# EAGLE design rec_2dek (EAGLE 6.1)
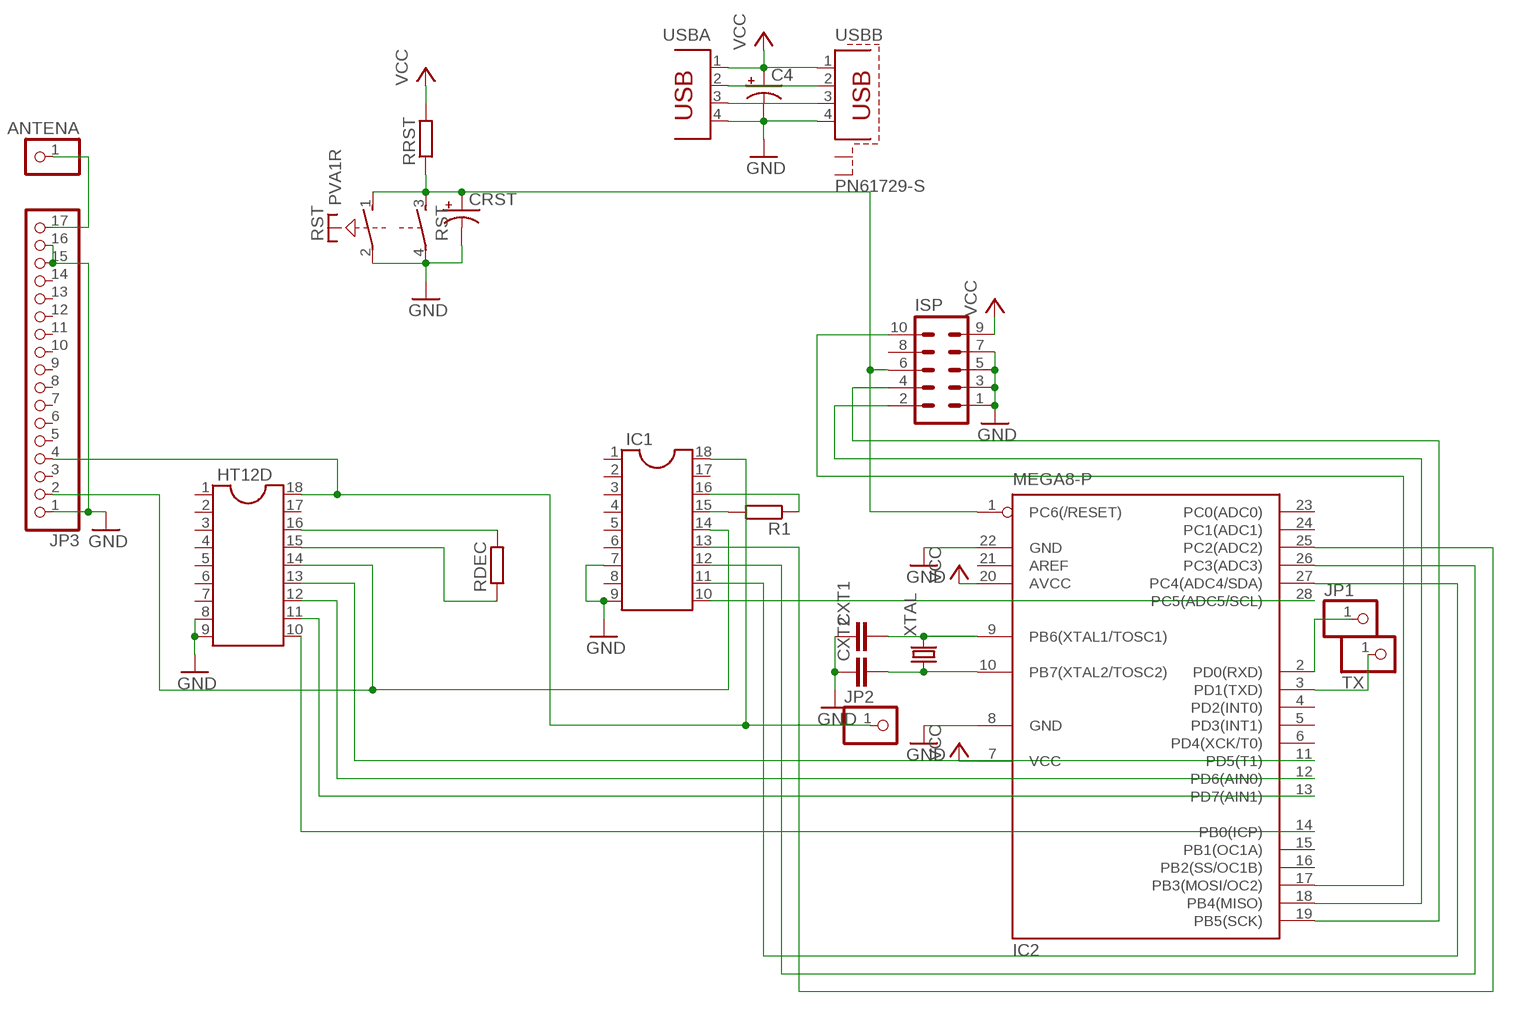
[diagram p0: schematic, sheet 1]

## Parts
ANTENA  PINHD-1X1  [1X01]
C4  CPOL-USE2.5-7  [E2,5-7]
CRST  CPOL-USE2.5-7  [E2,5-7]
CXT1  C2.5/2  [C2.5-2]
CXT2  C2.5/2  [C2.5-2]
HT12D  DIL18S  [SOCKET-18]
IC1  DIL18S  [SOCKET-18]
IC2  MEGA8-P  [DIL28-3]
ISP  MA05-2  [MA05-2]
JP1  PINHD-1X1  [1X01]
JP2  PINHD-1X1  [1X01]
JP3  PINHD-1X17  [1X17]
R1  R-EU_0207/12  [0207/12]
RDEC  R-EU_0309/12  [0309/12]
RRST  R-EU_0207/10  [0207/10]
RST  PVA1R  [PVA1R]
TX  PINHD-1X1  [1X01]
USBA  PN87520  [PN87520]
USBB  PN61729-S  [PN61729-S]
XTAL  CRYSTALHC49S  [HC49/S]

## Nets
GND: C4.- CRST.- CXT1.1 CXT2.1 HT12D.8 HT12D.9 IC1.7 IC1.9 IC2.8(GND) IC2.22(GND) ISP.1 ISP.3 ISP.5 ISP.7 JP3.1 JP3.15 JP3.16 RST.2(1:P) RST.4(2:P) USBA.4 USBB.4
N$1: CXT1.2 IC2.9(PB6(XTAL1/TOSC1)) XTAL.2
N$2: CXT2.2 IC2.10(PB7(XTAL2/TOSC2)) XTAL.1
N$3: IC2.3(PD1(TXD)) TX.1
N$4: IC2.19(PB5(SCK)) ISP.4
N$5: IC2.17(PB3(MOSI/OC2)) ISP.10
N$6: ANTENA.1 JP3.17
N$7: IC2.18(PB4(MISO)) ISP.2
N$8: CRST.+ IC2.1(PC6(/RESET)) ISP.6 RRST.1 RST.1(1:S) RST.3(2:S)
N$9: USBA.2 USBB.2
N$10: USBA.3 USBB.3
N$11: HT12D.10 IC2.14(PB0(ICP))
N$12: HT12D.11 IC2.13(PD7(AIN1))
N$13: HT12D.12 IC2.12(PD6(AIN0))
N$14: HT12D.13 IC2.11(PD5(T1))
N$15: HT12D.16 RDEC.2
N$16: HT12D.15 RDEC.1
N$17: HT12D.14 IC1.14 JP3.2
N$18: IC1.15 R1.2
N$19: HT12D.18 IC1.18 JP2.1 JP3.4
N$20: IC1.16 R1.1
N$21: IC1.10 IC2.28(PC5(ADC5/SCL))
N$22: IC1.11 IC2.27(PC4(ADC4/SDA))
N$23: IC1.12 IC2.26(PC3(ADC3))
N$24: IC1.13 IC2.25(PC2(ADC2))
N$25: IC2.2(PD0(RXD)) JP1.1
VCC: C4.+ IC2.7(VCC) IC2.20(AVCC) ISP.9 RRST.2 USBA.1 USBB.1
Unconnected: HT12D.1 HT12D.2 HT12D.3 HT12D.4 HT12D.5 HT12D.6 HT12D.7 HT12D.17 IC1.1 IC1.2 IC1.3 IC1.4 IC1.5 IC1.6 IC1.8 IC1.17 IC2.4(PD2(INT0)) IC2.5(PD3(INT1)) IC2.6(PD4(XCK/T0)) IC2.15(PB1(OC1A)) IC2.16(PB2(SS/OC1B)) IC2.21(AREF) IC2.23(PC0(ADC0)) IC2.24(PC1(ADC1)) ISP.8 JP3.3 JP3.5 JP3.6 JP3.7 JP3.8 JP3.9 JP3.10 JP3.11 JP3.12 JP3.13 JP3.14 USBB.S1 USBB.S2

## Library data of the parts
ANTENA JP1 JP2 TX = pinhead:PINHD-1X1: PIN HEADER
C4 CRST = resistor:CPOL-US: POLARIZED CAPACITOR, American symbol
CXT1 CXT2 = capacitor-wima:C: CAPACITOR naming: grid - package width
HT12D IC1 = ic-package:DIL18: Dual In Line / Socket
IC2 = atmel:MEGA8-P: MICROCONTROLLER 8 Kbytes FLASH, 1 kbytes SRAM, 512 bytes EEPROM, USART, 4-channel 10 bit ADC, 2-channel 8 bit ADC Pin compatible with Atmega48, ATMega88, ATMega168 Source: avr.lbr; OC_FARNELL: unknown; OC_NEWARK: unknown
ISP = con-lstb:MA05-2: PIN HEADER; OC_FARNELL: unknown; OC_NEWARK: unknown
JP3 = pinhead:PINHD-1X17: PIN HEADER
R1 RDEC RRST = resistor:R-EU_: RESISTOR, European symbol
RST = switch-misc:PVA1R: ITT SWITCH
USBA = con-berg:PN87520: BERG USB connector; OC_FARNELL: unknown; OC_NEWARK: unknown
USBB = con-berg:PN61729-S: BERG USB connector; OC_FARNELL: unknown; OC_NEWARK: unknown
XTAL = crystal:CRYSTAL: CRYSTAL; OC_FARNELL: 1667008; OC_NEWARK: unknown

## Board
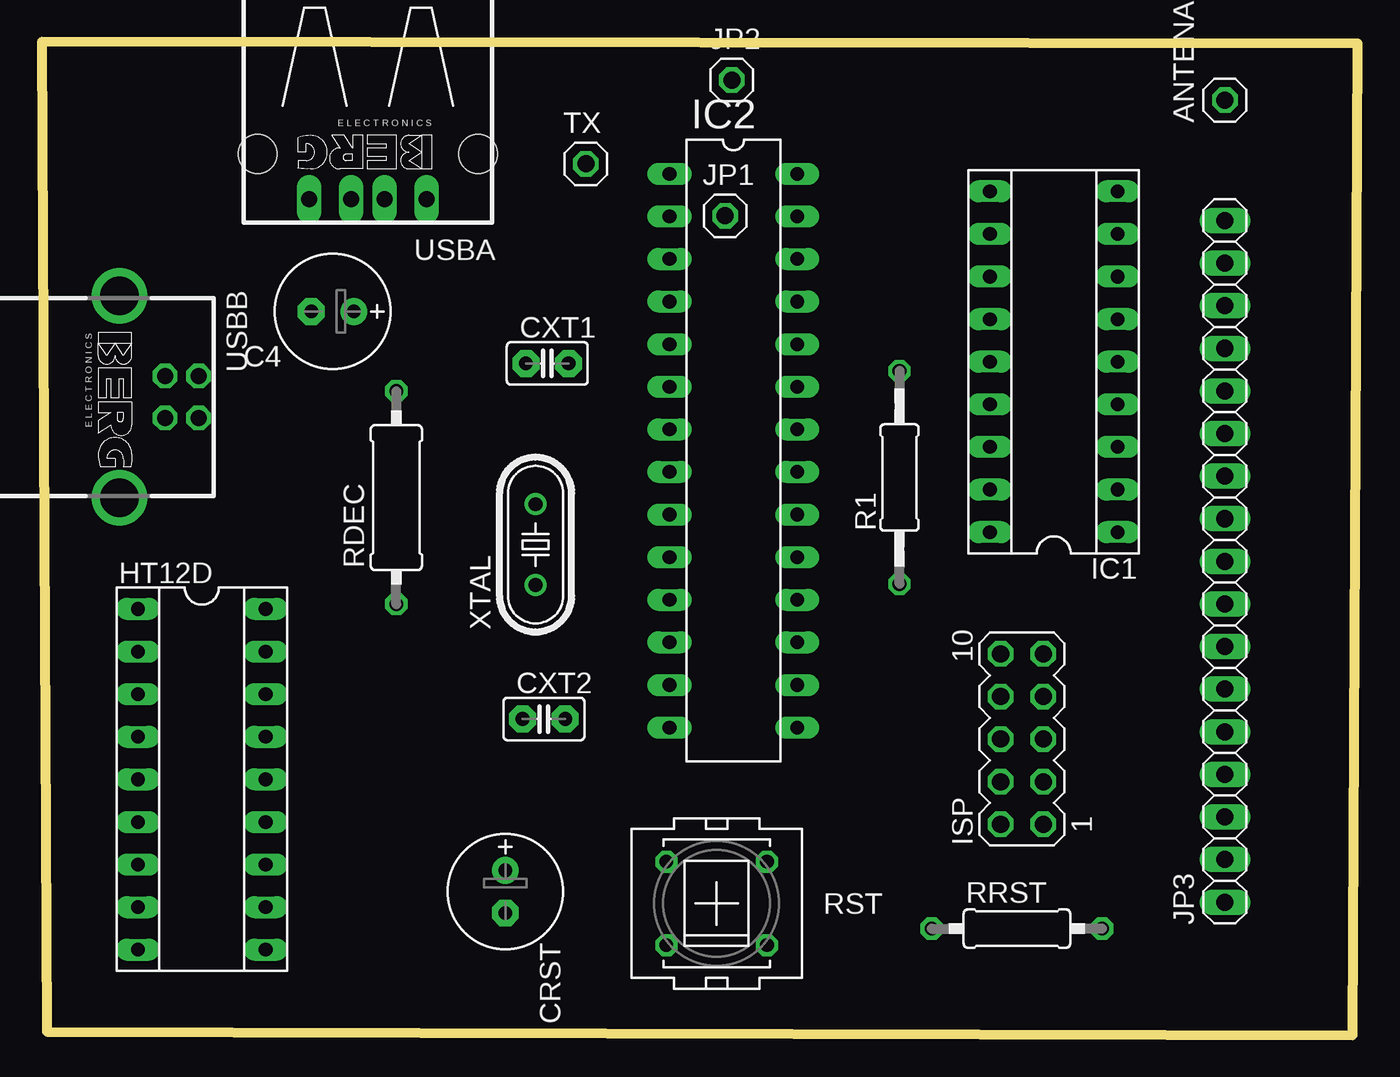
[diagram p1: board, top side]
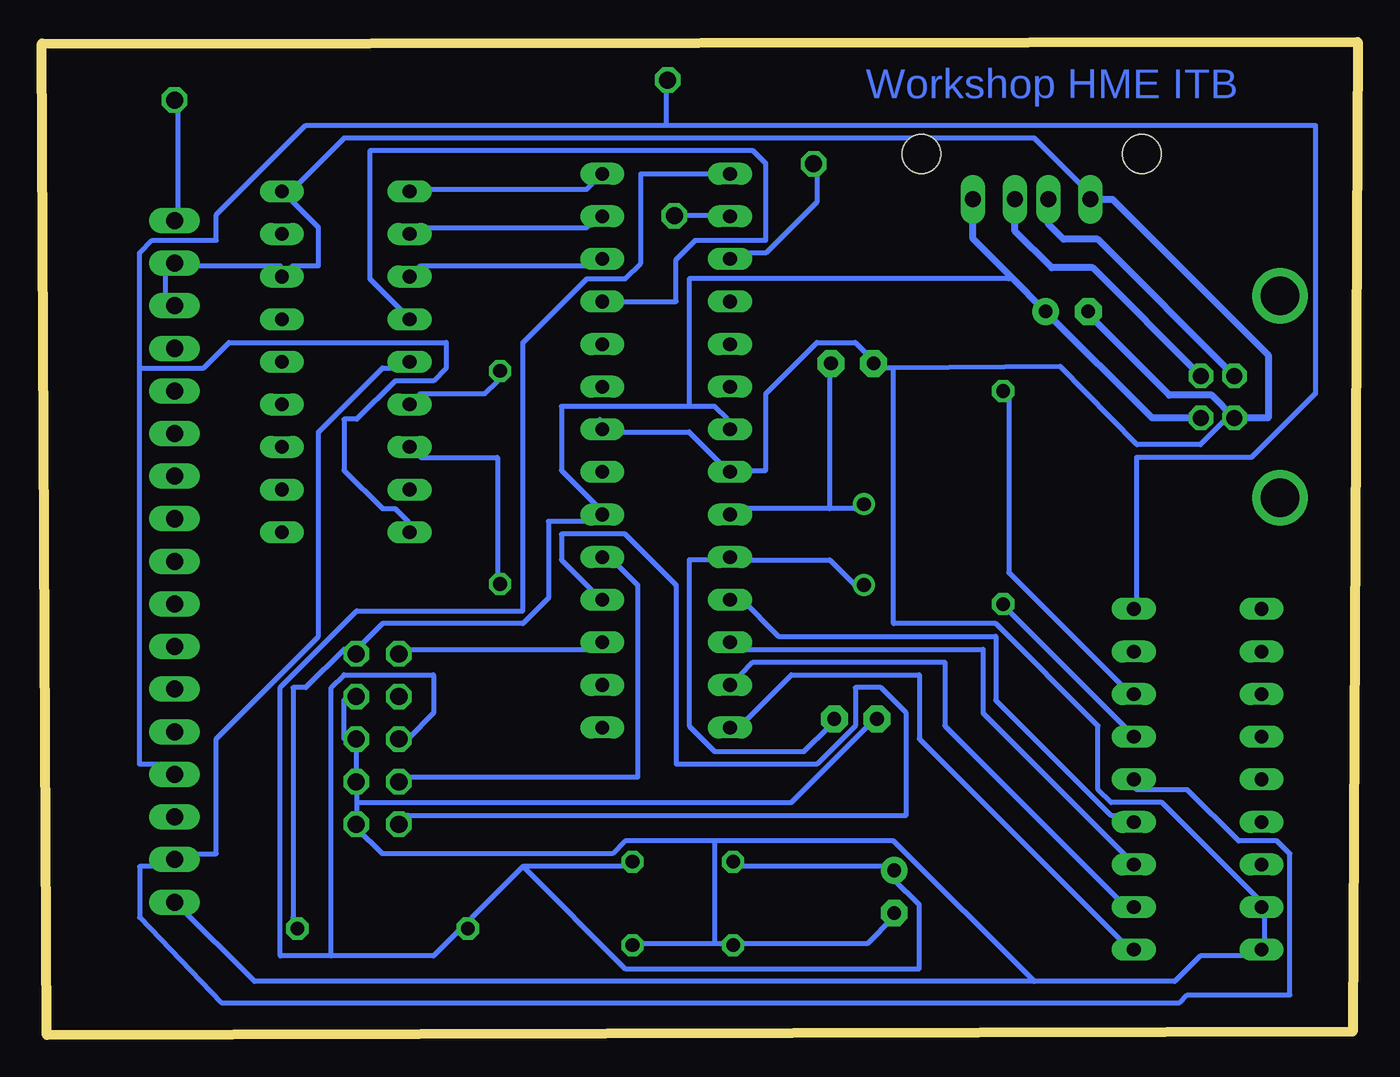
[diagram p2: board, bottom side, seen from below]

Size 78.44 x 59.22 mm. Coordinates in mm from the lower left corner, seen from the top.
Outline: 0.3,0.2 78.14,0 78.44,59.12 0,59.22 0.3,0.2
Copper layers (1*16): Top 0.035mm / dielectric 1.5mm / Bottom 0.035mm
Design rules: minimum track width 12mil, minimum drill 24mil, track to track 8mil, track to pad 8mil, pad to pad 8mil, via to via 8mil, smd to smd 8mil, copper to edge 40mil, drill to drill 8mil, minimum pad ring 10mil, minimum via ring 8mil, stop-mask expansion 4mil, vias tented up to drill 0mil, thermal gap 10mil

### Footprints (pad centres in the part's own frame; a part is rotated, then mirrored left to right if it is on the bottom)
1X01 = drill 1.016 octagon: 1 0,0
E2,5-7 = drill 0.813 pad 1.6: + -1.27,0 | drill 0.813 pad 1.6 octagon: - 1.27,0
C2.5-2 = drill 0.813 pad 1.6 octagon: 1 -1.27,0; 2 1.27,0
SOCKET-18 = drill 0.813 long: 1 -10.16,-3.81; 2 -7.62,-3.81; 3 -5.08,-3.81; 4 -2.54,-3.81; 5 0,-3.81; 6 2.54,-3.81; 7 5.08,-3.81; 8 7.62,-3.81; 9 10.16,-3.81; 10 10.16,3.81; 11 7.62,3.81; 12 5.08,3.81; 13 2.54,3.81; 14 0,3.81; 15 -2.54,3.81; 16 -5.08,3.81; 17 -7.62,3.81; 18 -10.16,3.81
DIL28-3 = drill 0.813 long: 1 -16.51,-3.81; 2 -13.97,-3.81; 3 -11.43,-3.81; 4 -8.89,-3.81; 5 -6.35,-3.81; 6 -3.81,-3.81; 7 -1.27,-3.81; 8 1.27,-3.81; 9 3.81,-3.81; 10 6.35,-3.81; 11 8.89,-3.81; 12 11.43,-3.81; 13 13.97,-3.81; 14 16.51,-3.81; 15 16.51,3.81; 16 13.97,3.81; 17 11.43,3.81; 18 8.89,3.81; 19 6.35,3.81; 20 3.81,3.81; 21 1.27,3.81; 22 -1.27,3.81; 23 -3.81,3.81; 24 -6.35,3.81; 25 -8.89,3.81; 26 -11.43,3.81; 27 -13.97,3.81; 28 -16.51,3.81
MA05-2 = drill 1.016 octagon: 1 -5.08,-1.27; 2 -5.08,1.27; 3 -2.54,-1.27; 4 -2.54,1.27; 5 0,-1.27; 6 0,1.27; 7 2.54,-1.27; 8 2.54,1.27; 9 5.08,-1.27; 10 5.08,1.27
1X17 = drill 1.016 long: 1 -20.32,0; 2 -17.78,0; 3 -15.24,0; 4 -12.7,0; 5 -10.16,0; 6 -7.62,0; 7 -5.08,0; 8 -2.54,0; 9 0,0; 10 2.54,0; 11 5.08,0; 12 7.62,0; 13 10.16,0; 14 12.7,0; 15 15.24,0; 16 17.78,0; 17 20.32,0
0207/12 = drill 0.813 octagon: 1 -6.35,0; 2 6.35,0
0309/12 = drill 0.813 octagon: 1 -6.35,0; 2 6.35,0
0207/10 = drill 0.813 octagon: 1 -5.08,0; 2 5.08,0
PVA1R = drill 0.813 octagon: 1 -2.997,2.489; 2 -2.997,-2.489; 3 2.997,2.489; 4 2.997,-2.489
PN87520 = drill 0.95 long: 1 -3.5,2.71; 2 -1,2.71; 3 1,2.71; 4 3.5,2.71 | hole 2.3: -6.57,0; 6.57,0
PN61729-S = drill 0.95 octagon: 1 1.25,4.71; 2 -1.25,4.71; 3 -1.25,2.71; 4 1.25,2.71 | drill 2.3 pad 2.9: S1 -6.02,0; S2 6.02,0
HC49/S = drill 0.813: 1 -2.413,0; 2 2.413,0

### Placement (x,y rotation side)
ANTENA  70.53,55.75 90 top
C4  17.33,43.15 180 top
CRST  27.63,8.55 270 top
CXT1  30.13,40.05 0 top
CXT2  29.93,18.85 0 top
HT12D  9.53,15.25 270 top
IC1  60.33,40.15 90 top
IC2  41.23,34.85 270 top
ISP  58.43,17.65 90 top
JP1  40.73,48.85 0 top
JP2  41.13,56.95 0 top
JP3  70.53,28.25 90 top
R1  51.13,33.25 90 top
RDEC  21.13,32.05 90 top
RRST  58.13,6.35 0 top
RST  40.23,7.85 0 top
TX  32.43,51.95 0 top
USBA  19.43,52.55 180 top
USBB  4.63,38.05 270 top
XTAL  29.43,29.25 90 top

### Tracks (layer width: path | path; a pad name or v marks a point on that pad's centre or on a via)
GND
  Bottom 0.305: 45.19,36.72 IC2.22 44.43,35.96 39.85,35.96 37.57,33.67 IC2.8 36.81,33.67 35.28,33.67 35.28,38.25 32.23,41.29 29.95,41.29 29.19,40.53 CXT1.1 28.42,39.77 27.66,39.77 | JP3.15 71.1,43.58 71.1,45.87 JP3.16 70.33,45.87 64.24,45.87 IC1.7 63.48,45.87 61.95,45.87 61.95,48.15 63.48,49.68 IC1.9 63.48,50.44 60.43,53.49 19.28,53.49 16.23,50.44 USBA.4 | 27.66,39.77 17.73,39.87 13.16,35.2 9.37,35.2 7.85,36.72 USBB.4 | 59.67,13.86 59.67,14.62 ISP.3 59.67,15.39 59.67,16.91 ISP.5 60.43,17.67 60.43,19.96 ISP.7 | 59.67,13.86 59.67,13.1 ISP.1 59.67,12.34 58.14,10.81 44.43,10.81 43.66,11.58 38.33,11.58 | 59.67,13.86 33.76,13.86 29.19,18.43 CXT2.1 | 38.33,5.48 42.9,5.48 RST.4 | 38.33,5.48 37.57,5.48 RST.2 36.81,5.48 29.19,5.48 27.66,7 CRST.- | 19.28,3.19 10.9,3.19 9.37,4.72 6.33,4.72 HT12D.9 5.56,5.48 5.56,7 HT12D.8 5.56,7.77 11.66,13.86 14.71,13.86 15.47,14.62 15.47,18.43 21.57,24.53 27.66,24.53 27.66,39.77 | 19.28,3.19 65.76,3.19 70.33,7.77 JP3.1 | 38.33,11.58 38.33,5.48 | 38.33,11.58 27.66,11.58 19.28,3.19
  Bottom 0.406: C4.- 16.06,42.98 11.23,38.15 8.69,38.15 USBB.4 5.33,36.8 5.33,40.55 14.62,49.84 USBA.4
N$1
  Bottom 0.305: 31.47,31.39 29.95,31.39 XTAL.2 | 31.47,31.39 36.81,31.39 IC2.9 | 31.47,31.39 31.47,39.77 CXT1.2
N$2
  Bottom 0.305: XTAL.1 29.95,26.82 31.47,28.34 36.81,28.34 IC2.10 37.57,28.34 39.85,28.34 39.85,18.43 38.33,16.91 33,16.91 31.47,18.43 CXT2.2
N$3
  Bottom 0.305: IC2.3 36.81,46.63 35.28,46.63 32.23,49.68 32.23,51.2 TX.1
N$4
  Bottom 0.305: IC2.19 44.43,28.34 42.9,26.82 42.9,15.39 56.62,15.39 ISP.4
N$5
  Bottom 0.305: IC2.17 45.19,23.01 56.62,23.01 ISP.10
N$6
  Bottom 0.305: JP3.17 70.33,48.91 70.33,55.01 ANTENA.1
N$7
  Bottom 0.305: IC2.18 45.19,26.05 47.47,28.34 47.47,29.86 43.66,29.86 40.62,26.82 40.62,16.15 32.23,16.15 29.95,18.43 29.95,20.72 28.42,20.72 26.9,19.2 26.9,13.1 56.62,13.1 ISP.2
N$8
  Bottom 0.305: RST.1 36.81,10.05 27.66,10.05 CRST.+ 27.66,9.29 26.14,7.77 26.14,3.96 43.66,3.96 49.76,10.05 | 49.76,10.05 52.81,7 RRST.1 53.57,6.24 55.09,4.72 61.19,4.72 | 49.76,10.05 43.66,10.05 RST.3 | 61.19,4.72 64.24,4.72 64.24,20.72 59.67,25.29 49.76,25.29 49.76,41.29 45.95,45.1 43.66,45.1 42.73,46.04 42.73,51.35 42.72,51.36 IC2.1 | 61.19,4.72 61.19,20.72 60.43,21.48 55.09,21.48 55.09,19.2 56.62,17.67 ISP.6
N$9
  Bottom 0.406: USBB.2 15.79,45.75 18.23,45.75 20.43,47.95 USBA.2
N$10
  Bottom 0.406: USBB.3 15.49,47.45 17.53,47.45 18.43,48.35 USBA.3
N$11
  Bottom 0.305: HT12D.10 13.95,5.48 26.14,17.67 26.14,21.48 33.76,21.48 36.81,18.43 IC2.14
N$12
  Bottom 0.305: HT12D.11 13.95,7.77 24.61,18.43 24.61,22.24 36.04,22.24 36.81,21.48 IC2.13
N$13
  Bottom 0.305: HT12D.12 13.95,10.81 22.33,19.2 22.33,23.01 36.81,23.01 IC2.12
N$14
  Bottom 0.305: HT12D.13 13.95,13.1 14.71,13.1 21.57,19.96 21.57,23.77 34.52,23.77 36.81,26.05 IC2.11
N$15
  Bottom 0.305: HT12D.16 13.95,20.72 20.8,27.58 20.8,38.25 RDEC.2
N$16
  Bottom 0.305: HT12D.15 13.95,18.43 20.8,25.29 RDEC.1
N$17
  Bottom 0.305: HT12D.14 13.18,14.62 10.14,14.62 7.09,11.58 4.8,11.58 4.04,10.81 4.04,2.39 10.14,2.39 10.6,1.93 67.75,1.93 72.62,7 72.62,10.05 71.1,10.05 JP3.2 70.33,10.81 68.05,10.81 68.05,17.67 61.95,23.77 61.95,35.96 58.14,39.77 56.62,39.77 IC1.14
N$18
  Bottom 0.305: R1.2 51.28,39.01 52.05,38.25 55.86,38.25 IC1.15
N$19
  Bottom 0.305: 41.23,54.25 62.71,54.25 68.05,48.91 68.05,47.39 71.86,47.39 72.62,46.63 72.62,39.77 | 41.23,54.25 2.52,54.25 2.52,38.25 6.33,34.44 13.18,34.44 13.18,26.05 HT12D.18 | 72.62,39.77 72.62,16.15 71.1,16.15 JP3.4 | 72.62,39.77 68.81,39.77 67.29,41.29 54.33,41.29 54.33,39.77 55.09,39.01 57.38,39.01 59.67,36.72 60.43,36.72 60.43,33.67 58.14,31.39 57.38,31.39 56.62,30.63 IC1.18 | JP2.1 41.23,56.85 41.23,54.25
N$20
  Bottom 0.305: R1.1 51.28,26.82 51.28,34.44 55.86,34.44 IC1.16
N$21
  Bottom 0.305: IC2.28 45.19,51.2 45.95,50.44 55.86,50.44 IC1.10
N$22
  Bottom 0.305: IC2.27 45.19,48.91 45.95,48.15 55.86,48.15 IC1.11
N$23
  Bottom 0.305: IC2.26 45.19,45.87 55.86,45.87 IC1.12
N$24
  Bottom 0.305: IC1.13 56.62,42.82 58.9,45.1 58.9,52.72 36.04,52.72 35.28,51.96 35.28,47.39 39.49,47.39 40.63,46.25 40.63,43.74 IC2.25
N$25
  Bottom 0.305: IC2.2 37.45,48.85 JP1.1
VCC
  Bottom 0.305: RRST.2 63.48,7 63.48,20.72 62.71,20.72 60.43,23.01 ISP.9 59.67,23.01 58.14,24.53 49.76,24.53 48.24,26.05 48.24,30.63 45.19,30.63 IC2.20 45.19,31.39 47.47,33.67 47.47,37.48 39.85,37.48 | 39.85,37.48 38.33,37.48 37.57,36.72 IC2.7 | 39.85,37.48 39.85,45.1 20.8,45.1 20.68,45.23
  Bottom 0.406: USBB.1 12.25,36.8 C4.+ 20.68,45.23 22.93,47.48 USBA.1

### Text on the board
Bottom: Workshop HME ITB